# EAGLE design led-matrix-proto (EAGLE 8.1.1)
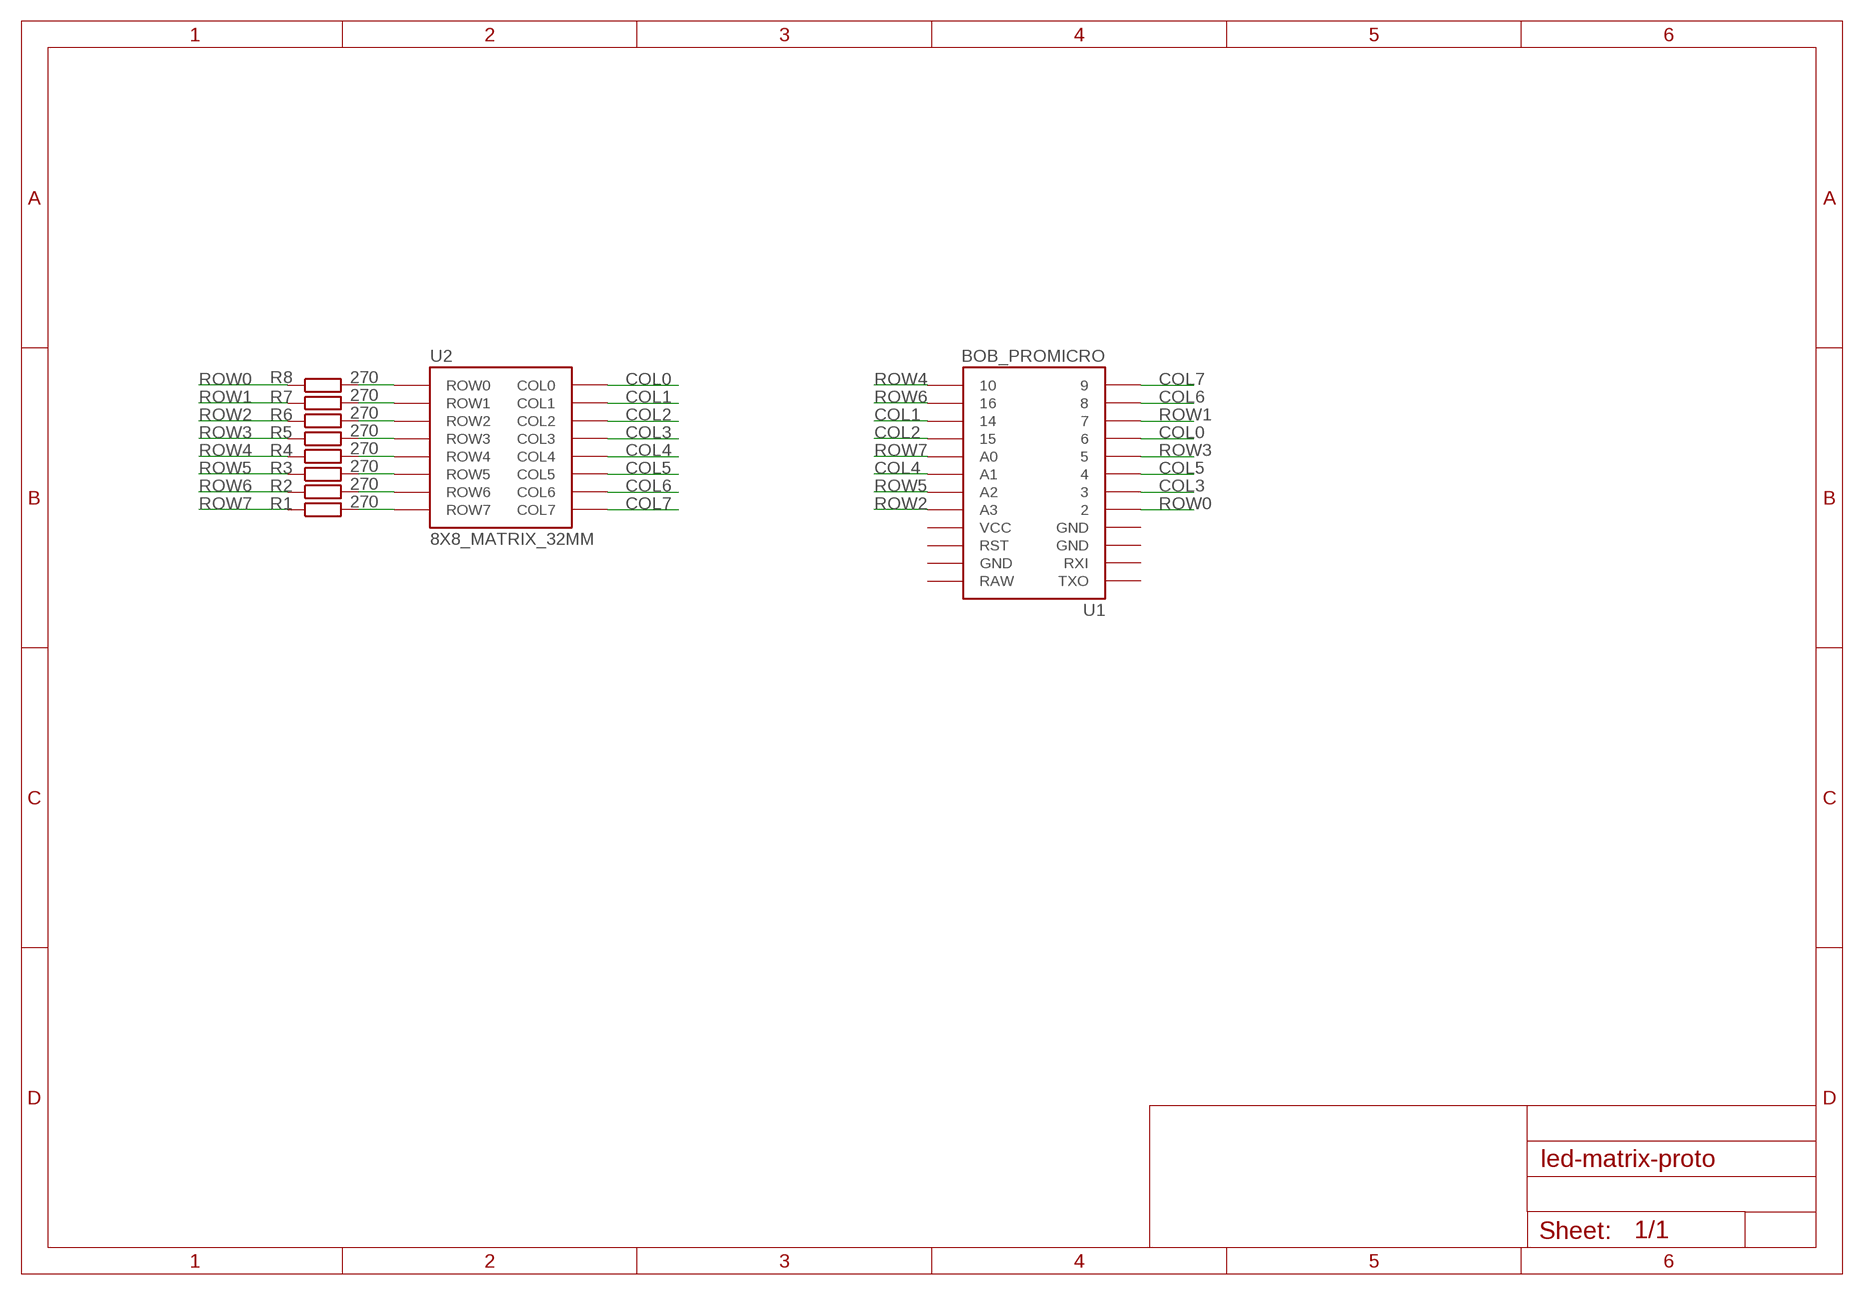
[diagram p0: schematic, sheet 1]

## Parts
R1  270  R-EU_R0603  [R0603]
R2  270  R-EU_R0603  [R0603]
R3  270  R-EU_R0603  [R0603]
R4  270  R-EU_R0603  [R0603]
R5  270  R-EU_R0603  [R0603]
R6  270  R-EU_R0603  [R0603]
R7  270  R-EU_R0603  [R0603]
R8  270  R-EU_R0603  [R0603]
U1  BOB_PROMICRO  [BOB_PROMICRO]
U2  8X8_MATRIX_32MM  [8X8_MATRIX_32MM]

## Nets
COL0: U1.6 U2.4(COL0)
COL1: U1.14 U2.14(COL1)
COL2: U1.15 U2.13(COL2)
COL3: U1.3 U2.7(COL3)
COL4: U1.A1 U2.11(COL4)
COL5: U1.4 U2.6(COL5)
COL6: U1.8 U2.2(COL6)
COL7: U1.9 U2.1(COL7)
N$1: R1.2 U2.12(ROW7)
N$2: R2.2 U2.15(ROW6)
N$3: R3.2 U2.10(ROW5)
N$4: R4.2 U2.16(ROW4)
N$5: R5.2 U2.5(ROW3)
N$6: R6.2 U2.9(ROW2)
N$7: R7.2 U2.3(ROW1)
N$8: R8.2 U2.8(ROW0)
ROW0: R8.1 U1.2
ROW1: R7.1 U1.7
ROW2: R6.1 U1.A3
ROW3: R5.1 U1.5
ROW4: R4.1 U1.10
ROW5: R3.1 U1.A2
ROW6: R2.1 U1.16
ROW7: R1.1 U1.A0
Unconnected: U1.GND@1(GND) U1.GND@2(GND) U1.GND@3(GND) U1.RAW U1.RST U1.RXI U1.TXO U1.VCC

## Library data of the parts
R1-R8 = rcl:R-EU_: RESISTOR, European symbol
U1 = Cesar:BOB_PROMICRO
U2 = Cesar:8X8_MATRIX_32MM: 8X8 LED matrix (HobbyComponents)

## Board
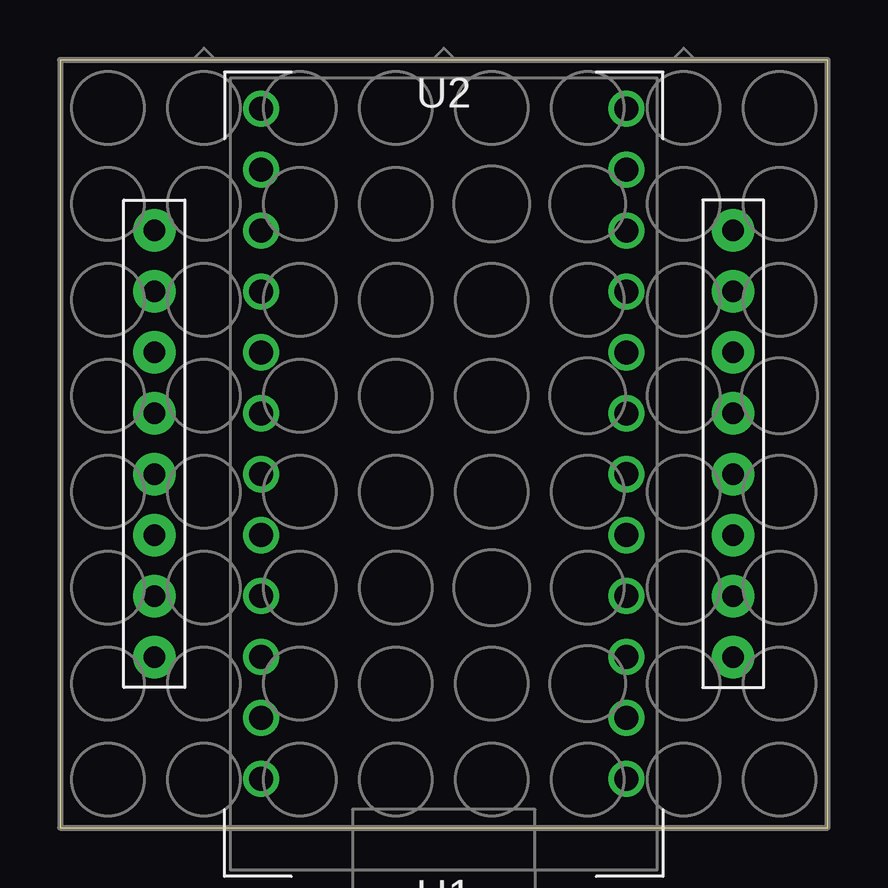
[diagram p1: board, top side]
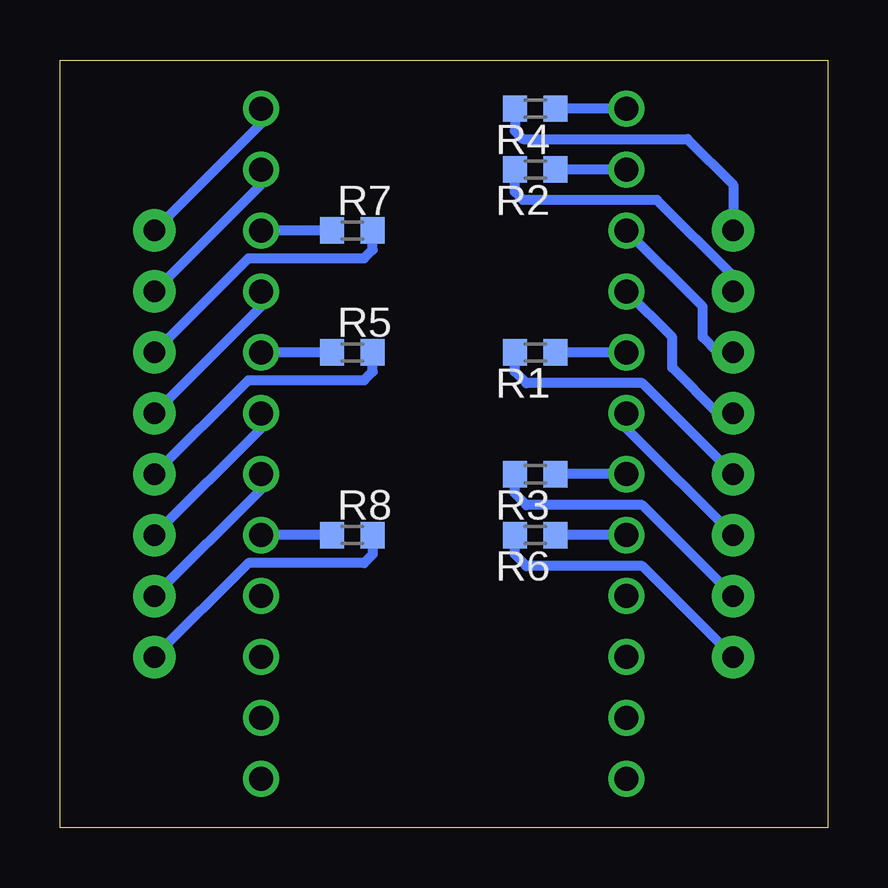
[diagram p2: board, bottom side, seen from below]

Size 32 x 32 mm. Coordinates in mm from the lower left corner, seen from the top.
Outline: 0,0 32,0 32,32 0,32 0,0
Copper layers (1*16): Top 0.035mm / dielectric 1.5mm / Bottom 0.035mm
Design rules "default": minimum track width 10mil, minimum drill 24mil, track to track 8mil, track to pad 8mil, pad to pad 8mil, via to via 8mil, smd to smd 8mil, copper to edge 40mil, drill to drill 8mil, minimum pad ring 10mil, minimum via ring 8mil, stop-mask expansion 4mil, vias tented up to drill 0mil, thermal gap 10mil

### Footprints (pad centres in the part's own frame; a part is rotated, then mirrored left to right if it is on the bottom)
R0603 = smd 1 x 1.1: 1 -0.85,0; 2 0.85,0
BOB_PROMICRO = drill 1: 2 -7.62,2.54; 3 -7.62,0; 4 -7.62,-2.54; 5 -7.62,-5.08; 6 -7.62,-7.62; 7 -7.62,-10.16; 8 -7.62,-12.7; 9 -7.62,-15.24; 10 7.62,-15.24; 14 7.62,-10.16; 15 7.62,-7.62; 16 7.62,-12.7; A0 7.62,-5.08; A1 7.62,-2.54; A2 7.62,0; A3 7.62,2.54; GND@1 -7.62,7.62; GND@2 -7.62,5.08; GND@3 7.62,10.16; RAW 7.62,12.7; RST 7.62,7.62; RXI -7.62,10.16; TXO -7.62,12.7; VCC 7.62,5.08
8X8_MATRIX_32MM = drill 0.9 pad 1.778: 1 12.065,8.89; 2 12.065,6.35; 3 12.065,3.81; 4 12.065,1.27; 5 12.065,-1.27; 6 12.065,-3.81; 7 12.065,-6.35; 8 12.065,-8.89; 9 -12.065,-8.89; 10 -12.065,-6.35; 11 -12.065,-3.81; 12 -12.065,-1.27; 13 -12.065,1.27; 14 -12.065,3.81; 15 -12.065,6.35; 16 -12.065,8.89

### Placement (x,y rotation side)
R1  12.19,19.81 180 bottom
R2  12.19,27.43 180 bottom
R3  12.19,14.73 180 bottom
R4  12.19,29.97 180 bottom
R5  19.81,19.81 0 bottom
R6  12.19,12.19 180 bottom
R7  19.81,24.89 0 bottom
R8  19.81,12.19 0 bottom
U1  16,14.73 180 top
U2  16,16 0 top

### Tracks (layer width: path | path; a pad name or v marks a point on that pad's centre or on a via)
COL0
  Bottom 0.406: U1.6 23.62,21.71 U2.4
COL1
  Bottom 0.406: U2.14 4.57,19.81 5.21,20.45 5.21,21.71 U1.14
COL2
  Bottom 0.406: U2.13 4.57,17.27 6.48,19.17 6.48,20.45 U1.15
COL3
  Bottom 0.406: U1.3 23.62,14.1 U2.7
COL4
  Bottom 0.406: U1.A1 8.38,16.63 U2.11
COL5
  Bottom 0.406: U1.4 23.62,16.63 U2.6
COL6
  Bottom 0.406: U1.8 23.62,26.79 U2.2
COL7
  Bottom 0.406: U1.9 23.62,29.33 U2.1
N$1
  Bottom 0.406: 12.96,19.81 R1.2 13.04,19.01 12.55,18.52 7.73,18.52 U2.12
N$2
  Bottom 0.406: R2.2 13.04,26.5 12.7,26.16 7.11,26.16 3.94,22.98 U2.15
N$3
  Bottom 0.406: 12.96,14.73 R3.2 13.04,13.93 12.55,13.44 7.73,13.44 U2.10
N$4
  Bottom 0.406: R4.2 13.04,29.04 12.7,28.7 5.84,28.7 3.94,26.79 U2.16
N$5
  Bottom 0.406: 19.04,19.81 R5.2 18.96,19.01 19.32,18.65 24.14,18.65 U2.5
N$6
  Bottom 0.406: 12.96,12.19 R6.2 13.04,11.39 12.55,10.9 7.73,10.9 U2.9
N$7
  Bottom 0.406: 19.04,24.89 R7.2 18.96,24.09 19.32,23.73 24.14,23.73 U2.3
N$8
  Bottom 0.406: 19.04,12.19 R8.2 18.96,11.39 19.32,11.03 24.14,11.03 U2.8
ROW0
  Bottom 0.406: R8.1 U1.2
ROW1
  Bottom 0.406: R7.1 U1.7
ROW2
  Bottom 0.406: U1.A3 R6.1
ROW3
  Bottom 0.406: R5.1 U1.5
ROW4
  Bottom 0.406: U1.10 R4.1
ROW5
  Bottom 0.406: U1.A2 R3.1
ROW6
  Bottom 0.406: U1.16 R2.1
ROW7
  Bottom 0.406: U1.A0 R1.1